# EAGLE design WeatherLight_Router (EAGLE 9.4.0)
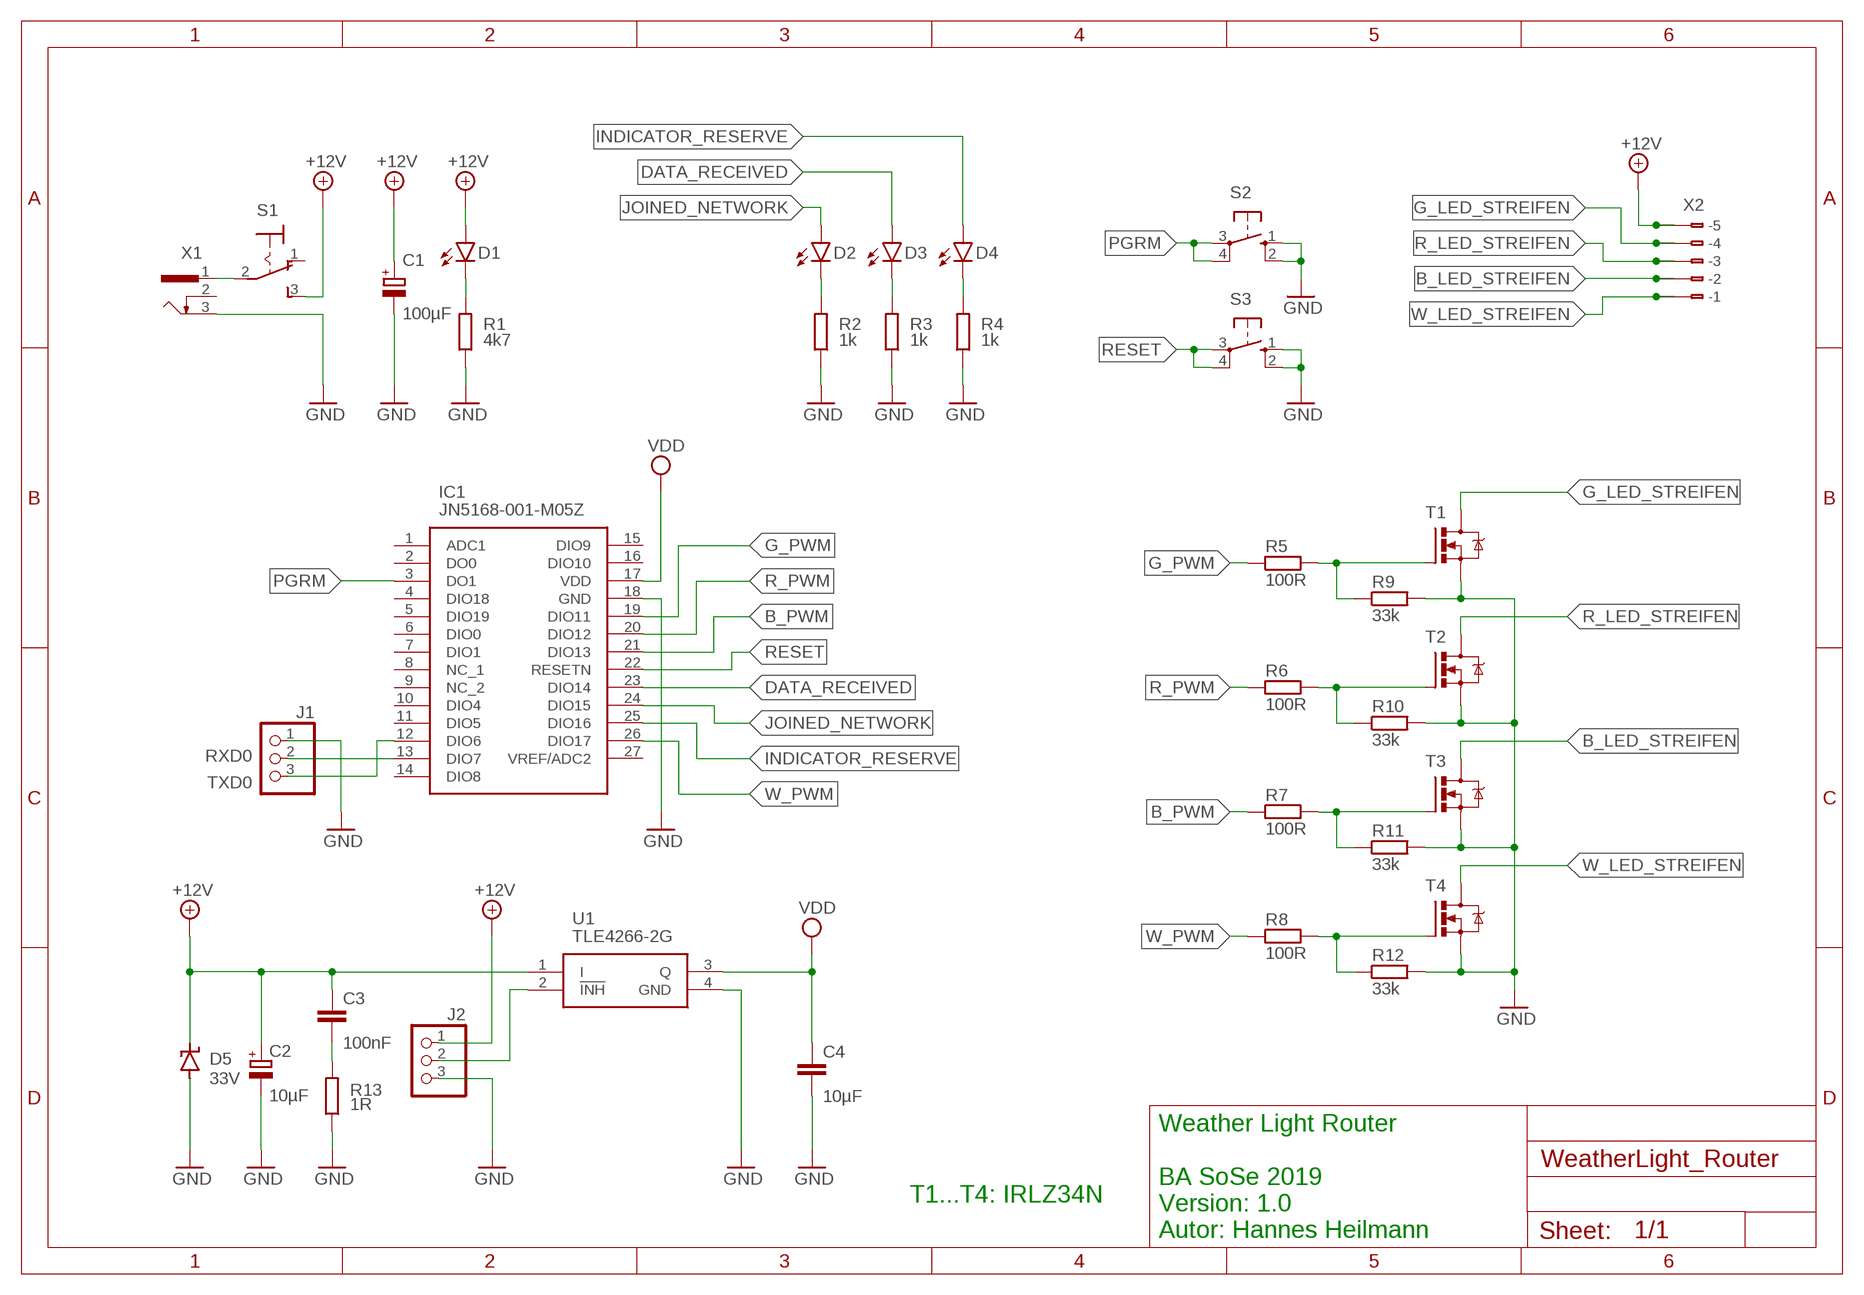
[diagram p0: schematic, sheet 1]

## Parts
C1  100µF  CPOL-EUD  [PANASONIC_D]
C2  10µF  CPOL-EUB  [PANASONIC_B]
C3  100nF  C-EUC1206  [C1206]
C4  10µF  C-EUC1206K  [C1206K]
D1  LEDCHIPLED_1206  [CHIPLED_1206]
D2  LEDCHIPLED_1206  [CHIPLED_1206]
D3  LEDCHIPLED_1206  [CHIPLED_1206]
D4  LEDCHIPLED_1206  [CHIPLED_1206]
D5  33V  SUPPRESSOR-SMBJ  [SMBJ]
IC1  JN5168-001-M05Z  [JN5168001M05Z]
J1  PINHD-1X3  [1X03]
J2  PINHD-1X3  [1X03]
R1  4k7  R-EU_R1206  [R1206]
R2  1k  R-EU_R1206  [R1206]
R3  1k  R-EU_R1206  [R1206]
R4  1k  R-EU_R1206  [R1206]
R5  100R  R-EU_R1206  [R1206]
R6  100R  R-EU_R1206  [R1206]
R7  100R  R-EU_R1206  [R1206]
R8  100R  R-EU_R1206  [R1206]
R9  33k  R-EU_R1206  [R1206]
R10  33k  R-EU_R1206  [R1206]
R11  33k  R-EU_R1206  [R1206]
R12  33k  R-EU_R1206  [R1206]
R13  1R  R-EU_R1206  [R1206]
S1  M9040P  [M9040P]
S2  10-XX  [B3F-10XX]
S3  10-XX  [B3F-10XX]
T1  IRLZ44Z  [TO220BH]
T2  IRLZ44Z  [TO220BH]
T3  IRLZ44Z  [TO220BH]
T4  IRLZ44Z  [TO220BH]
U1  TLE4266-2G  [SOT230P700X170-4N]
X1  NEB21R  [NEB21R]
X2  233-505  [233-505]

## Nets
+12V: C1.+ C2.+ C3.1 D1.A D5.C J2.1 S1.3(S) U1.1(I) X2.A5(-5) X2.B5(B-5)
B_LED_STREIFEN: T3.D X2.A2(-2) X2.B2(B-2)
B_PWM: IC1.21(DIO13) R7.1
DATA_RECEIVED: D3.A IC1.23(DIO14)
G_LED_STREIFEN: T1.D X2.A4(-4) X2.B4(B-4)
G_PWM: IC1.19(DIO11) R5.1
GND: C1.- C2.- C4.2 D5.A IC1.18(GND) J1.1 J2.3 R1.1 R2.1 R3.1 R4.1 R9.2 R10.2 R11.2 R12.2 R13.1 S2.1(S) S2.2(S1) S3.1(S) S3.2(S1) T1.S T2.S T3.S T4.S U1.4(GND) X1.3
INDICATOR_RESERVE: D4.A IC1.25(DIO16)
JOINED_NETWORK: D2.A IC1.24(DIO15)
N$1: J2.2 U1.2(!INH)
N$2: S1.2(P) X1.1
N$3: D1.C R1.2
N$4: D4.C R4.2
N$5: R7.2 R11.1 T3.G
N$6: R8.2 R12.1 T4.G
N$7: R6.2 R10.1 T2.G
N$8: R5.2 R9.1 T1.G
N$9: D3.C R3.2
N$10: D2.C R2.2
N$11: C3.2 R13.2
PGRM: IC1.3(DO1) S2.3(P) S2.4(P1)
R_LED_STREIFEN: T2.D X2.A3(-3) X2.B3(B-3)
R_PWM: IC1.20(DIO12) R6.1
RESET: IC1.22(RESETN) S3.3(P) S3.4(P1)
RXD0: IC1.13(DIO7) J1.2
TXD0: IC1.12(DIO6) J1.3
VDD: C4.1 IC1.17(VDD) U1.3(Q)
W_LED_STREIFEN: T4.D X2.A1(-1) X2.B1(B-1)
W_PWM: IC1.26(DIO17) R8.1
Unconnected: IC1.1(ADC1) IC1.2(DO0) IC1.4(DIO18) IC1.5(DIO19) IC1.6(DIO0) IC1.7(DIO1) IC1.8(NC_1) IC1.9(NC_2) IC1.10(DIO4) IC1.11(DIO5) IC1.14(DIO8) IC1.15(DIO9) IC1.16(DIO10) IC1.27(VREF/ADC2) S1.1(O) X1.2

## Notes on the sheet
- T1...T4: IRLZ34N
- Weather Light Router
  
  BA SoSe 2019
  Version: 1.0
  Autor: Hannes Heilmann

## Library data of the parts
C1 C2 = rcl:CPOL-EU: POLARIZED CAPACITOR, European symbol; SPICEPREFIX: C
C3 C4 = rcl:C-EU: CAPACITOR, European symbol; SPICEPREFIX: C
D1-D4 = led:LED: LED OSRAM: - CHIPLED LG R971, LG N971, LY N971, LG Q971, LY Q971, LO R971, LY R971 LH N974, LH R974 LS Q976, LO Q976, LY Q976 LO Q996 - Hyper CHIPLED LW Q18S LB Q993, LB Q99A, LB R99A - SideLED LS A670, LO A670, LY A670, LG A670, LP A670 LB A673, LV A673, LT A673, LW A673 LH A674 LY A675 LS A676, LA A676, LO A676, LY A676, LW A676 LS A679, LY A679, LG A679 - Hyper Micro SIDELED® LS Y876, LA Y876, LO Y876, LY Y876 LT Y87S - SmartLED LW L88C, LW L88S LB L89C, LB L89S, LG L890 LS L89K, LO L89K, LY L89K LS L896, LA L896, LO L896, LY L896 - TOPLED LS T670, LO T670, LY T670, LG T670, LP T670 LSG T670, LSP T670, LSY T670, LOP T670, LYG T670 LG T671, LOG T671, LSG T671 LB T673, LV T673, LT T673, LW T673 LH T674 LS T676, LA T676, LO T676, LY T676, LB T676, LH T676, LSB T676, LW T676 LB T67C, LV T67C, LT T67C, LS T67K, LO T67K, LY T67K, LW E67C LS E67B, LA E67B, LO E67B, LY E67B, LB E67C, LV E67C, LT E67C LW T67C LS T679, LY T679, LG T679 LS T770, LO T770, LY T770, LG T770, LP T770 LB T773, LV T773, LT T773, LW T773 LH T774 LS E675, LA E675, LY E675, LS T675 LS T776, LA T776, LO T776, LY T776, LB T776 LHGB T686 LT T68C, LB T68C - Hyper Mini TOPLED® LB M676 - Mini TOPLED Santana® LG M470 LS M47K, LO M47K, LY M47K Source: http://www.osram.convergy.de LUXEON: - LUMILED® LXK2-PW12-R00, LXK2-PW12-S00, LXK2-PW14-U00, LXK2-PW14-V00 LXK2-PM12-R00, LXK2-PM12-S00, LXK2-PM14-U00 LXK2-PE12-Q00, LXK2-PE12-R00, LXK2-PE12-S00, LXK2-PE14-T00, LXK2-PE14-U00 LXK2-PB12-K00, LXK2-PB12-L00, LXK2-PB12-M00, LXK2-PB14-N00, LXK2-PB14-P00, LXK2-PB14-Q00 LXK2-PR12-L00, LXK2-PR12-M00, LXK2-PR14-Q00, LXK2-PR14-R00 LXK2-PD12-Q00, LXK2-PD12-R00, LXK2-PD12-S00 LXK2-PH12-R00, LXK2-PH12-S00 LXK2-PL12-P00, LXK2-PL12-Q00, LXK2-PL12-R00 Source: www.luxeon.com KINGBRIGHT: KA-3528ASYC Source: www.kingbright.com
D5 = diode:SUPPRESSOR-: Suppressor diode
IC1 = SamacSys_Parts:JN5168-001-M05Z: NXP - JN5168-001-M05Z - RF MOD, IEEE802.15.4, MED PWR, UFL CONN Source: Datasheet <https://www.nxp.com/docs/en/data-sheet/JN5168-001-MXX.pdf>; DESCRIPTION: NXP - JN5168-001-M05Z - RF MOD, IEEE802.15.4, MED PWR, UFL CONN; HEIGHT: 5mm; MANUFACTURER_NAME: Nexperia; MANUFACTURER_PART_NUMBER: JN5168-001-M05Z; MOUSER_PART_NUMBER: 771-JN5168-001-M05Z; MOUSER_PRICE-STOCK: https://www.mouser.com/Search/Refine.aspx?Keyword=771-JN5168-001-M05Z
J1 J2 = pinhead:PINHD-1X3: PIN HEADER
R1-R13 = rcl:R-EU_: RESISTOR, European symbol; SPICEPREFIX: R
S1 = switch:M9040P: TOGGLE SWITCH Marquardt
S2 S3 = switch-omron:10-XX: OMRON SWITCH; MPN: B3F-1000; OC_FARNELL: 176432; OC_NEWARK: 36M3542
T1-T4 = SamacSys_Parts:IRLZ44Z: N-Channel HEXFET® Power MOSFET Logic Level AUTOMOTIVE MOSFET Source: http://www.irf.com/product-info/datasheets/data/irlz44zpbf.pdf
U1 = SamacSys_Parts:TLE4266-2G: Infineon TLE4266-2G, LDO Voltage Regulator, 150mA, 5 V +/-3%, 5.5 45 Vin, 3+Tab-Pin SOT-223 Source: Datasheet <http://www.infineon.com/dgdl/Infineon-TLE4266-2-DS-v01_40-EN.pdf?fileId=5546d46259d9a4bf0159f94369cf3e1b>; DESCRIPTION: Infineon TLE4266-2G, LDO Voltage Regulator, 150mA, 5 V +/-3%, 5.5 45 Vin, 3+Tab-Pin SOT-223; HEIGHT: 1.7mm; MANUFACTURER_NAME: Infineon; MANUFACTURER_PART_NUMBER: TLE4266-2G; MOUSER_PART_NUMBER: 726-TLE42662G; MOUSER_PRICE-STOCK: https://www.mouser.com/Search/Refine.aspx?Keyword=726-TLE42662G
X1 = SamacSys_Parts:NEB21R: Netzgeräte-Einbaukupplung abgewinkelte Ausführung mit Öffner Source: http://www.lumberg.com/Produkte/PDFs/NEB21R.pdf; MPN: NEB 21 R; OC_FARNELL: 1217037; OC_NEWARK: 97K6458
X2 = con-wago:233-505: WAGO Cage Clamp; MF: Wago Corporation; MPN: 0233-0505; OC_FARNELL: unknown; OC_NEWARK: 79K2051

## Board
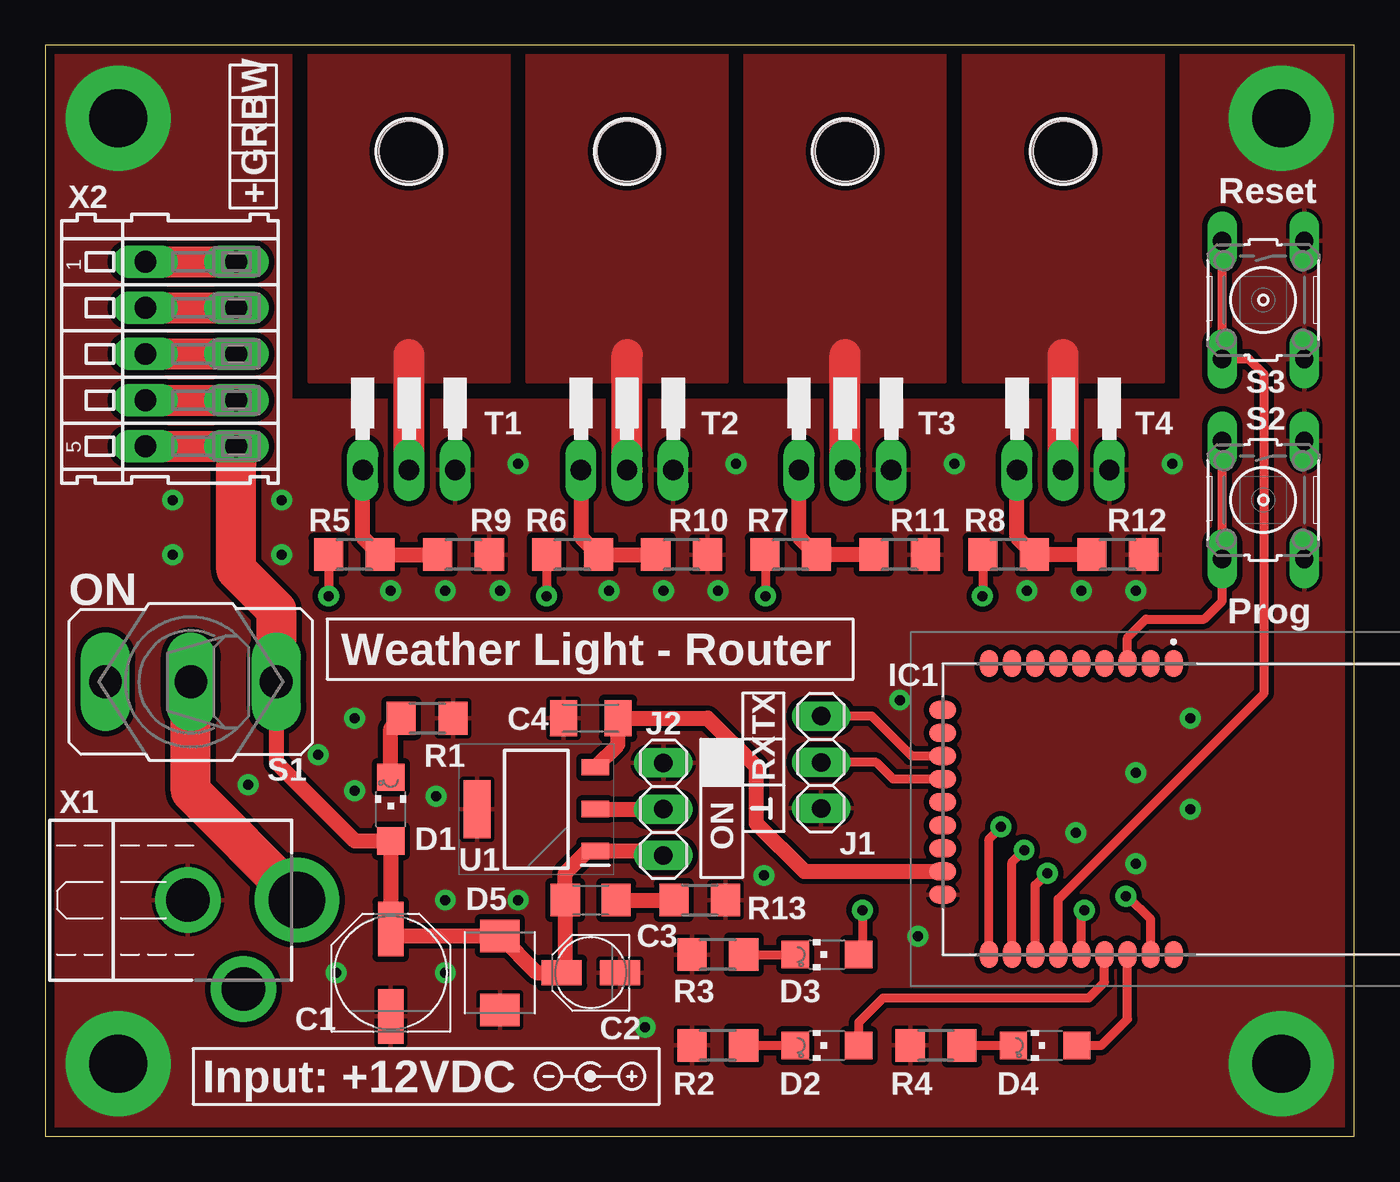
[diagram p1: board, top side]
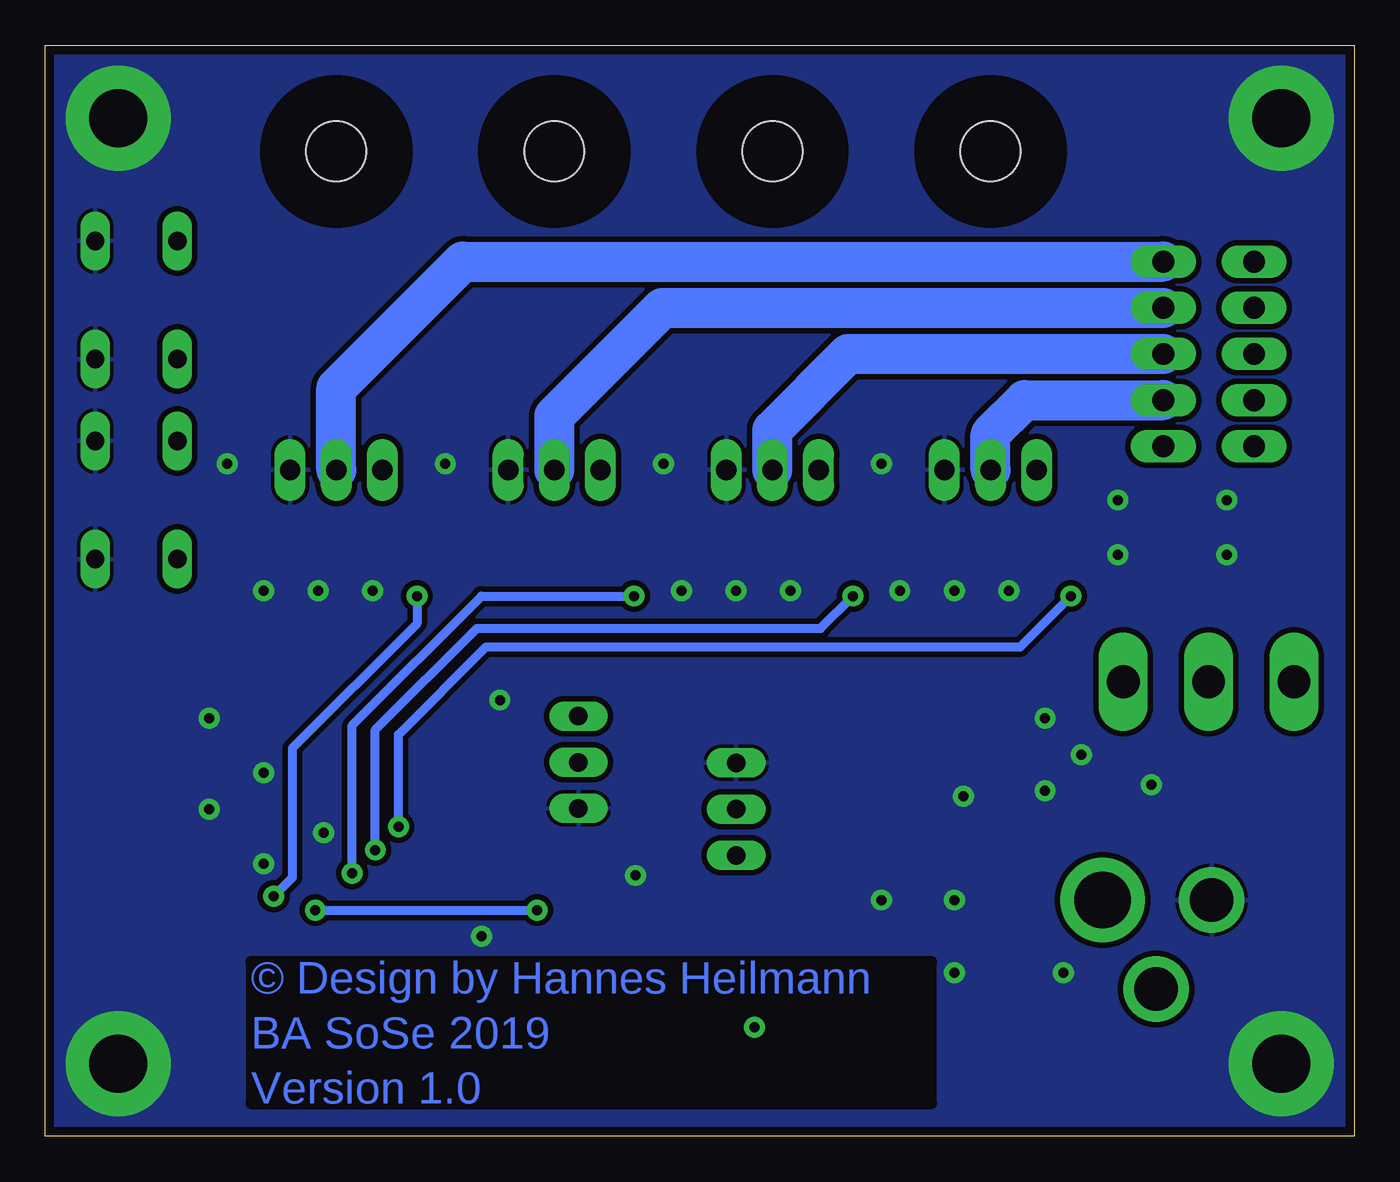
[diagram p2: board, bottom side, seen from below]

Size 72 x 60 mm. Coordinates in mm from the lower left corner, seen from the top.
Outline: 0,0 72,0 72,60 0,60 0,0
Copper layers (1*16): Top 0.035mm / dielectric 1.5mm / Bottom 0.035mm
Design rules "FVM_default": minimum track width 0.3mm, minimum drill 0.4mm, track to track 0.3mm, track to pad 0.3mm, pad to pad 0.3mm, via to via 0.3mm, smd to smd 0.15mm, copper to edge 0.5mm, drill to drill 0.2mm, minimum pad ring 0.3mm, minimum via ring 0.3mm, stop-mask expansion 0.075mm, vias tented up to drill 0mil, thermal gap 0.2mm

### Footprints (pad centres in the part's own frame; a part is rotated, then mirrored left to right if it is on the bottom)
PANASONIC_D = smd 3 x 1.4: + 2.4,0; - -2.4,0
PANASONIC_B = smd 2.2 x 1.4: + 1.6,0; - -1.6,0
C1206 = smd 1.6 x 1.8: 1 -1.4,0; 2 1.4,0
C1206K = smd 1.5 x 2: 1 -1.5,0; 2 1.5,0
CHIPLED_1206 = smd 1.5 x 1.5: A 0,-1.75; C 0,1.75
SMBJ = smd 1.78 x 2.16: A 2.04,0; C -2.03,0
JN5168001M05Z = smd 1.5 x 1: 1 -8,-1.925; 2 -8,-3.195; 3 -8,-4.465; 4 -8,-5.735; 5 -8,-7.005; 6 -8,-8.275; 7 -8,-9.545; 8 -8,-10.815; 9 -8,-12.085; 19 8,-12.085; 20 8,-10.815; 21 8,-9.545; 22 8,-8.275; 23 8,-7.005; 24 8,-5.735; 25 8,-4.465; 26 8,-3.195; 27 8,-1.925 | smd 1 x 1.5: 10 -5.46,-14.625; 11 -4.19,-14.625; 12 -2.92,-14.625; 13 -1.65,-14.625; 14 -0.38,-14.625; 15 0.89,-14.625; 16 2.16,-14.625; 17 3.43,-14.625; 18 4.7,-14.625
1X03 = drill 1.016 long: 1 -2.54,0; 2 0,0; 3 2.54,0
R1206 = smd 1.6 x 1.803: 1 -1.422,0; 2 1.422,0
M9040P = drill 1.803 long: 1 0,4.699; 2 0,0; 3 0,-4.699
B3F-10XX = drill 1.016 long: 1 -3.251,2.261; 2 3.251,2.261; 3 -3.251,-2.261; 4 3.251,-2.261
TO220BH = drill 1.118 long: D 0,-6.35; G -2.54,-6.35; S 2.54,-6.35 | hole 3.302: 0,11.176
SOT230P700X170-4N = smd 1.5 x 0.9: 1 -3.25,2.3; 2 -3.25,0; 3 -3.25,-2.3 | smd 1.5 x 3.2: 4 3.25,0
NEB21R = drill 3.1: 1 0,7.341 | drill 2.4: 2 4.902,4.394; 3 0,1.346
233-505 = drill 1.2 long: A1 -5.08,2.5; A2 -2.54,2.5; A3 0,2.5; A4 2.54,2.5; A5 5.08,2.5; B1 -5.08,-2.5; B2 -2.54,-2.5; B3 0,-2.5; B4 2.54,-2.5; B5 5.08,-2.5

### Placement (x,y rotation side)
C1  19,9 90 top
C2  30,9 180 top
C3  30,13 0 top
C4  30,23 180 top
D1  19,18 0 top
D2  43,5 90 top
D3  43,10 90 top
D4  55,5 90 top
D5  25,9 270 top
IC1  64,18 270 top
J1  42.67,20.57 90 top
J2  34,18 90 top
R1  21,23 180 top
R2  37,5 0 top
R3  37,10 0 top
R4  49,5 0 top
R5  17,32 0 top
R6  29,32 0 top
R7  41,32 0 top
R8  53,32 0 top
R9  23,32 0 top
R10  35,32 0 top
R11  47,32 0 top
R12  59,32 0 top
R13  36,13 180 top
S1  8,25 90 top
S2  67,35 270 top
S3  67,46 270 top
T1  20,43 0 top
T2  32,43 0 top
T3  44,43 0 top
T4  56,43 0 top
U1  27,18 180 top
X1  6.49,13 270 top
X2  8,43.03 270 top

### Tracks (layer width: path | path; a pad name or v marks a point on that pad's centre or on a via)
+12V
  Top 0.813: J2.1 33.76,15.7 U1.1 29.82,15.7 28.6,14.48 C3.1 28.6,9.2 C2.+ 27.03,9 D5.C 19.43,11.03 C1.+ D1.A 17.02,16.25 12.7,20.57 S1.3
  Top 1.27: 10.5,37 X2.A5
  Top 1.7: X2.B5 X2.A5
  Top 2.2: S1.3 12.7,28.96 10.5,31.16 10.5,37
B_LED_STREIFEN
  Top 1.7: X2.B2 X2.A2 | T3.D 44,43
  Bottom 2.2: T3.D 44,39.62 38.05,45.57 X2.A2
  pour Top: 38.5,59.5 38.5,41.5 49.5,41.5 49.5,59.5
B_PWM  (via drill 0.55)
  Top 0.508: R7.1 39.62,31.95 v39.62,29.72 | IC1.21 54.45,13.81 v55.12,14.48
  Bottom 0.508: v55.12,14.48 55.12,22.61 48.01,29.72 v39.62,29.72
DATA_RECEIVED  (via drill 0.55)
  Top 0.508: IC1.23 56.99,12.29 v57.15,12.45 | v44.96,12.45 44.96,10.21 D3.A
  Bottom 0.508: v57.15,12.45 v44.96,12.45
G_LED_STREIFEN
  Top 1.7: X2.B4 X2.A4 | T1.D 20,43
  Bottom 2.2: T1.D 20,38.61 18.12,40.49 X2.A4
  pour Top: 14.5,59.5 14.5,41.5 25.5,41.5 25.5,59.5
G_PWM  (via drill 0.55)
  Top 0.508: R5.1 v15.58,29.72 | IC1.19 51.91,16.36 v52.58,17.02
  Bottom 0.508: v15.58,29.72 18.37,26.92 47.75,26.92 52.58,22.1 v52.58,17.02
GND  (via drill 0.55, 3.2)
  other vias: 60,30 57,30 54,30 37,30 34,30 31,30 25,30 22,30 19,30 17,23 15,21 17,19 22,13 63,18 60,15 63,23 60,20 11.16,19.35 16,9 22,9 33,6 48,11 7,35 7,32 26,13 13,35 13,32 26,37 38,37 50,37 62,37 4,56 68,56 68,4 4,4 47,24 21.49,18.71 39.52,14.35 56.7,16.7
  pour Top: 0.5,59.5 13.5,59.5 13.5,40.5 62.5,40.5 62.5,59.5 71.5,59.5 71.5,0.5 0.5,0.5
  pour Bottom: 0.5,59.5 0.5,0.5 71.5,0.5 71.5,59.5
INDICATOR_RESERVE
  Top 0.508: D4.A 58.09,5 59.53,6.45 IC1.25
JOINED_NETWORK
  Top 0.508: D2.A 44.75,6.27 46.1,7.62 57.4,7.62 58.27,8.48 IC1.24
N$1
  Top 0.813: U1.2 J2.2
N$2
  Top 2.2: X1.1 13.83,13.13 8,18.97 S1.2
N$3
  Top 0.813: D1.C 19,22.42 R1.2
N$4
  Top 0.508: R4.2 D4.C
N$5
  Top 0.813: T3.G 41.46,32.96 R7.2 R11.1
N$6
  Top 0.813: T4.G 53.46,32.96 R8.2 R12.1
N$7
  Top 0.813: T2.G 29.46,32.96 R6.2 R10.1
N$8
  Top 0.813: T1.G 17.46,32.96 R5.2 R9.1
N$9
  Top 0.508: R3.2 D3.C
N$10
  Top 0.508: R2.2 D2.C
N$11
  Top 0.813: C3.2 R13.2
PGRM
  Top 0.508: IC1.3 59.53,27.43 60.55,28.45 63.75,28.45 64.74,29.43 S2.4 S2.3
R_LED_STREIFEN
  Top 1.7: X2.B3 X2.A3 | T2.D 32,43
  Bottom 1.7: 32,38.86
  Bottom 2.2: T2.D 32,38.86 | 32,38.86 27.83,43.03 X2.A3
  pour Top: 26.5,59.5 26.5,41.5 37.5,41.5 37.5,59.5
R_PWM  (via drill 0.55)
  Top 0.508: R6.1 v27.58,29.72 | IC1.20 53.19,15.09 v53.85,15.75
  Bottom 0.508: v27.58,29.72 29.36,27.94 48.26,27.94 53.85,22.35 v53.85,15.75
RESET
  Top 0.508: IC1.22 55.73,13.05 67.06,24.38 67.06,41.91 66.22,42.75 S3.4 S3.3
RXD0
  Top 0.508: IC1.13 46.64,19.65 45.72,20.57 J1.2
TXD0
  Top 0.508: IC1.12 47.66,20.92 45.47,23.11 J1.3
VDD
  Top 0.813: U1.3 31.5,21.55 C4.1 36.44,23 39.12,20.32 39.12,17.21 41.75,14.57 IC1.17
W_LED_STREIFEN
  Top 1.7: X2.B1 X2.A1 | T4.D 56,43
  Bottom 2.2: T4.D 56,41.15 49.04,48.11 X2.A1
  pour Top: 50.5,59.5 50.5,41.5 61.5,41.5 61.5,59.5
W_PWM  (via drill 0.55)
  Top 0.508: R8.1 51.58,29.73 v51.56,29.72 | IC1.26 60.8,11.94 59.53,13.21 v59.44,13.21
  Bottom 0.508: v51.56,29.72 51.56,28.19 58.42,21.34 58.42,14.22 v59.44,13.21

### Text on the board
Bottom: © Design by Hannes Heilmann / BA SoSe 2019 / Version 1.0
tNames: W | B | R | G | + | Reset | ON | Prog | Weather Light - Router | TX | RX | ON | Input: +12VDC